# EAGLE schematic BlinkyBoard (EAGLE 6.3)
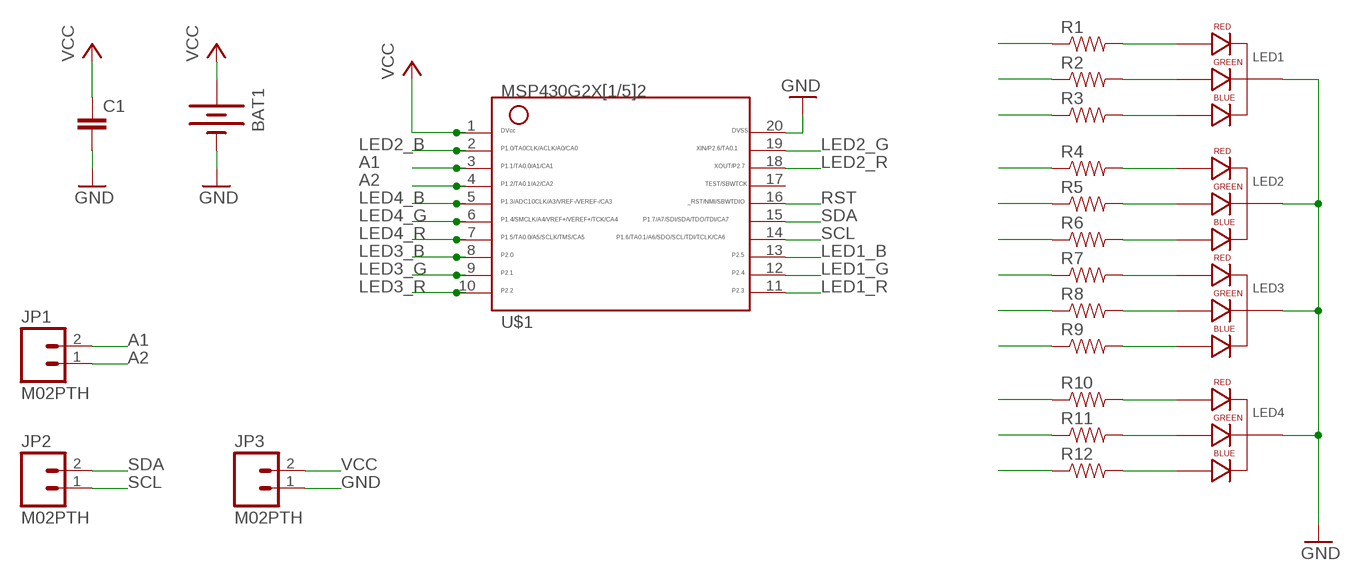
[diagram p0: schematic, sheet 1]

## Parts
BAT1  BATTERY20PTH  [BATTCOM_20MM_PTH]
C1  CAPKIT  [CAP-PTH-SMALL-KIT]
JP1  M02PTH  [1X02]
JP2  M02PTH  [1X02]
JP3  M02PTH  [1X02]
LED1  LED-RGB-CC-THRUDIFFUSE  [LED-RGB-THRU]
LED2  LED-RGB-CC-THRUDIFFUSE  [LED-RGB-THRU]
LED3  LED-RGB-CC-THRUDIFFUSE  [LED-RGB-THRU]
LED4  LED-RGB-CC-THRUDIFFUSE  [LED-RGB-THRU]
R1  RESISTORKIT  [AXIAL-0.3-KIT]
R2  RESISTORKIT  [AXIAL-0.3-KIT]
R3  RESISTORKIT  [AXIAL-0.3-KIT]
R4  RESISTORKIT  [AXIAL-0.3-KIT]
R5  RESISTORKIT  [AXIAL-0.3-KIT]
R6  RESISTORKIT  [AXIAL-0.3-KIT]
R7  RESISTORKIT  [AXIAL-0.3-KIT]
R8  RESISTORKIT  [AXIAL-0.3-KIT]
R9  RESISTORKIT  [AXIAL-0.3-KIT]
R10  RESISTORKIT  [AXIAL-0.3-KIT]
R11  RESISTORKIT  [AXIAL-0.3-KIT]
R12  RESISTORKIT  [AXIAL-0.3-KIT]
U$1  G2X[1/5]2---N20  [N20]

## Nets
A1: JP1.2 U$1.3
A2: JP1.1 U$1.4
GND: BAT1.2(-) C1.2 JP3.1 LED1.2(CATHODE) LED2.2(CATHODE) LED3.2(CATHODE) LED4.2(CATHODE) U$1.20
LED1_B: R3.P$1 U$1.13
LED1_G: R2.P$1 U$1.12
LED1_R: R1.P$1 U$1.11
LED2_B: R6.P$1 U$1.2
LED2_G: R5.P$1 U$1.19
LED2_R: R4.P$1 U$1.18
LED3_B: R9.P$1 U$1.8
LED3_G: R8.P$1 U$1.9
LED3_R: R7.P$1 U$1.10
LED4_B: R12.P$1 U$1.5
LED4_G: R11.P$1 U$1.6
LED4_R: R10.P$1 U$1.7
N$1: LED1.1(RED_CATHODE) R1.P$2
N$2: LED1.3(GREEN_CATHODE) R2.P$2
N$3: LED1.4(BLUE_CATHODE) R3.P$2
N$4: LED2.1(RED_CATHODE) R4.P$2
N$5: LED2.3(GREEN_CATHODE) R5.P$2
N$6: LED2.4(BLUE_CATHODE) R6.P$2
N$7: LED3.1(RED_CATHODE) R7.P$2
N$8: LED3.3(GREEN_CATHODE) R8.P$2
N$9: LED3.4(BLUE_CATHODE) R9.P$2
N$10: LED4.1(RED_CATHODE) R10.P$2
N$11: LED4.3(GREEN_CATHODE) R11.P$2
N$12: LED4.4(BLUE_CATHODE) R12.P$2
RST: U$1.16
SCL: JP2.1 U$1.14
SDA: JP2.2 U$1.15
VCC: BAT1.1(+) C1.1 JP3.2 U$1.1
Unconnected: U$1.17

## Library data of the parts
BAT1 = SparkFun-Electromechanical:BATTERY: Battery Holders Various common sizes : AA, AAA, 20mm coin cell and 12mm coin cell. 20MM_4LEGS, BATT-10373
C1 = SparkFun-Capacitors:CAP: Capacitor Standard 0603 ceramic capacitor, and 0.1" leaded capacitor.
JP1-JP3 = SparkFun-Connectors:M02: Standard 2-pin 0.1" header. Use with - straight break away headers ( PRT-00116) - right angle break away headers (PRT-00553) - swiss pins (PRT-00743) - machine pins (PRT-00117) - female headers (PRT-00115) Molex polarized connector foot print use with: PRT-08233 with associated crimp pins and housings. 2.54_SCREWTERM for use with PRT-10571. 3.5mm Screw Terminal footprints for PRT-08084 5mm Screw Terminal footprints for use with PRT-08433
LED1-LED4 = SparkFun-LED:LED-RGB-CC-THRU: RGB Through-hole common cathode LED SparkFun Storefront: COM-00105 (Clear) COM-09264 (Diffuse); PROD_ID: DIO-09434
R1-R12 = SparkFun-Resistors:RESISTOR: Resistor Basic schematic elements and footprints for 0603, 1206, and PTH resistors.
U$1 = TI_MSP430_v16:G2X[1/5]2---N20: MSP430G2X[1/5]2 MSP430G2x52, MSP430G2x12 PDIP (N) 20 Pin Package http://focus.ti.com/docs/prod/folders/print/msp430g2452.html